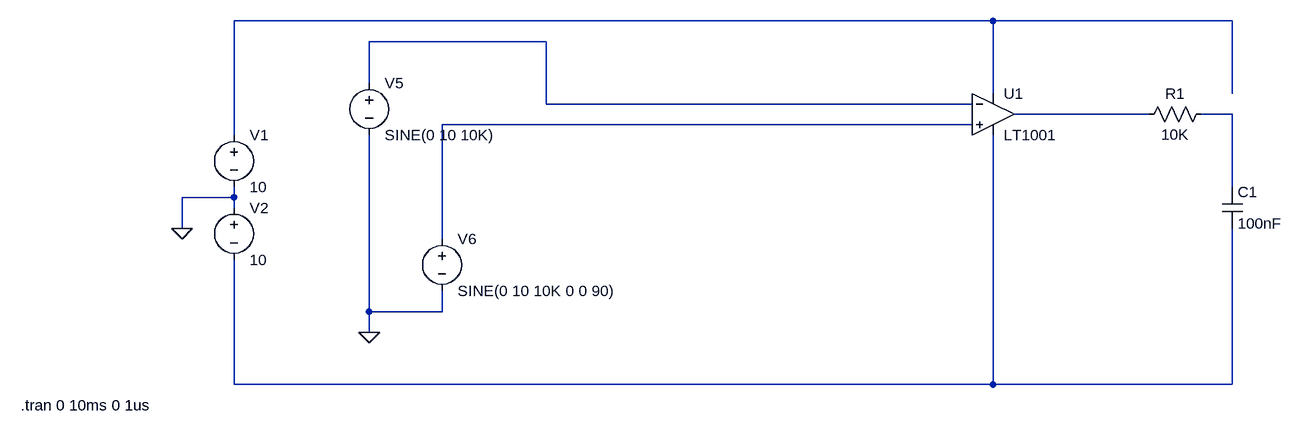
[diagram p0: schematic phase_detector.asc]
phase_detector.asc, the LTspice schematic file:
Version 4
SHEET 1 1448 680
WIRE 592 -80 -576 -80
WIRE 960 -80 592 -80
WIRE -96 -48 -368 -48
WIRE -368 16 -368 -48
WIRE 592 32 592 -80
WIRE 960 32 960 -80
WIRE -96 48 -96 -48
WIRE 560 48 -96 48
WIRE 832 64 624 64
WIRE 960 64 912 64
WIRE 560 80 -256 80
WIRE -576 96 -576 -80
WIRE 960 176 960 64
WIRE -576 192 -576 176
WIRE -576 192 -656 192
WIRE -576 208 -576 192
WIRE -656 240 -656 192
WIRE -256 256 -256 80
WIRE -368 368 -368 96
WIRE -256 368 -256 336
WIRE -256 368 -368 368
WIRE -368 400 -368 368
WIRE -576 480 -576 288
WIRE 592 480 592 96
WIRE 592 480 -576 480
WIRE 960 480 960 240
WIRE 960 480 592 480
FLAG -656 240 0
FLAG -368 400 0
SYMBOL Opamps\\LT1001 592 0 R0
SYMATTR InstName U1
SYMBOL voltage -576 80 R0
WINDOW 123 0 0 Left 2
WINDOW 39 0 0 Left 2
SYMATTR InstName V1
SYMATTR Value 10
SYMBOL voltage -576 192 R0
WINDOW 123 0 0 Left 2
WINDOW 39 0 0 Left 2
SYMATTR InstName V2
SYMATTR Value 10
SYMBOL voltage -368 0 R0
WINDOW 123 0 0 Left 2
WINDOW 39 0 0 Left 2
SYMATTR InstName V5
SYMATTR Value SINE(0 10 10K)
SYMBOL voltage -256 240 R0
WINDOW 123 0 0 Left 2
WINDOW 39 0 0 Left 2
SYMATTR InstName V6
SYMATTR Value SINE(0 10 10K 0 0 90)
SYMBOL res 928 48 R90
WINDOW 0 0 56 VBottom 2
WINDOW 3 32 56 VTop 2
SYMATTR InstName R1
SYMATTR Value 10K
SYMBOL cap 944 176 R0
SYMATTR InstName C1
SYMATTR Value 100nF
TEXT -904 512 Left 2 !.tran 0 10ms 0 1us

The netlist it stands for:
* phase_detector.asc
XU1 N005 N002 N001 N006 N003 LT1001  ; pins In+ In- V+ V- OUT
V1 N001 0 10
V2 0 N006 10
V5 N002 0 SINE(0 10 10K)
V6 N005 0 SINE(0 10 10K 0 0 90)
R1 N004 N003 10K
C1 N004 N006 100nF
.tran 0 10ms 0 1us
.lib LTC.lib
.backanno
.end